# Altium schematic sheet VL6180.SchDoc
size A
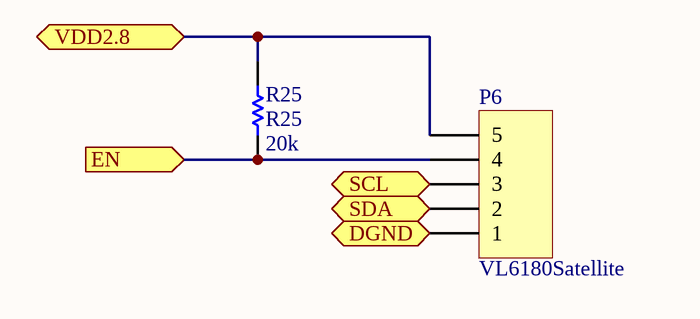
[diagram p0: VL6180.SchDoc]

## Parts
P6  VL6180Satellite  [PH_5_PTH]
R25  R25  value 20k  [RES_0805]

## Ports
DGND, EN (in), SCL (bidir), SDA (bidir), VDD2.8

## Nets
DGND: P6.1 ; port DGND
EN: P6.4 R25.1 ; port EN
SCL: P6.3 ; port SCL
SDA: P6.2 ; port SDA
VDD2.8: P6.5 R25.2 ; port VDD2.8

## Library data of the parts
P6 = Header 5: Header, 5-Pin; LatestRevisionDate: 17-Jul-2002; LatestRevisionNote: Re-released for DXP Platform.; Publisher: Altium Limited
R25 = Res1: Resistor; Published: 8-Jun-2000; LatestRevisionDate: 17-Jul-2002; LatestRevisionNote: Re-released for DXP Platform.; PackageReference: AXIAL-0.3; Publisher: Altium Limited; PackageDescription: Axial Device, Thru-Hole; 2 Leads; 0.3 in Pin Spacing